# EAGLE design IM920sL_module (EAGLE 9.6.2)
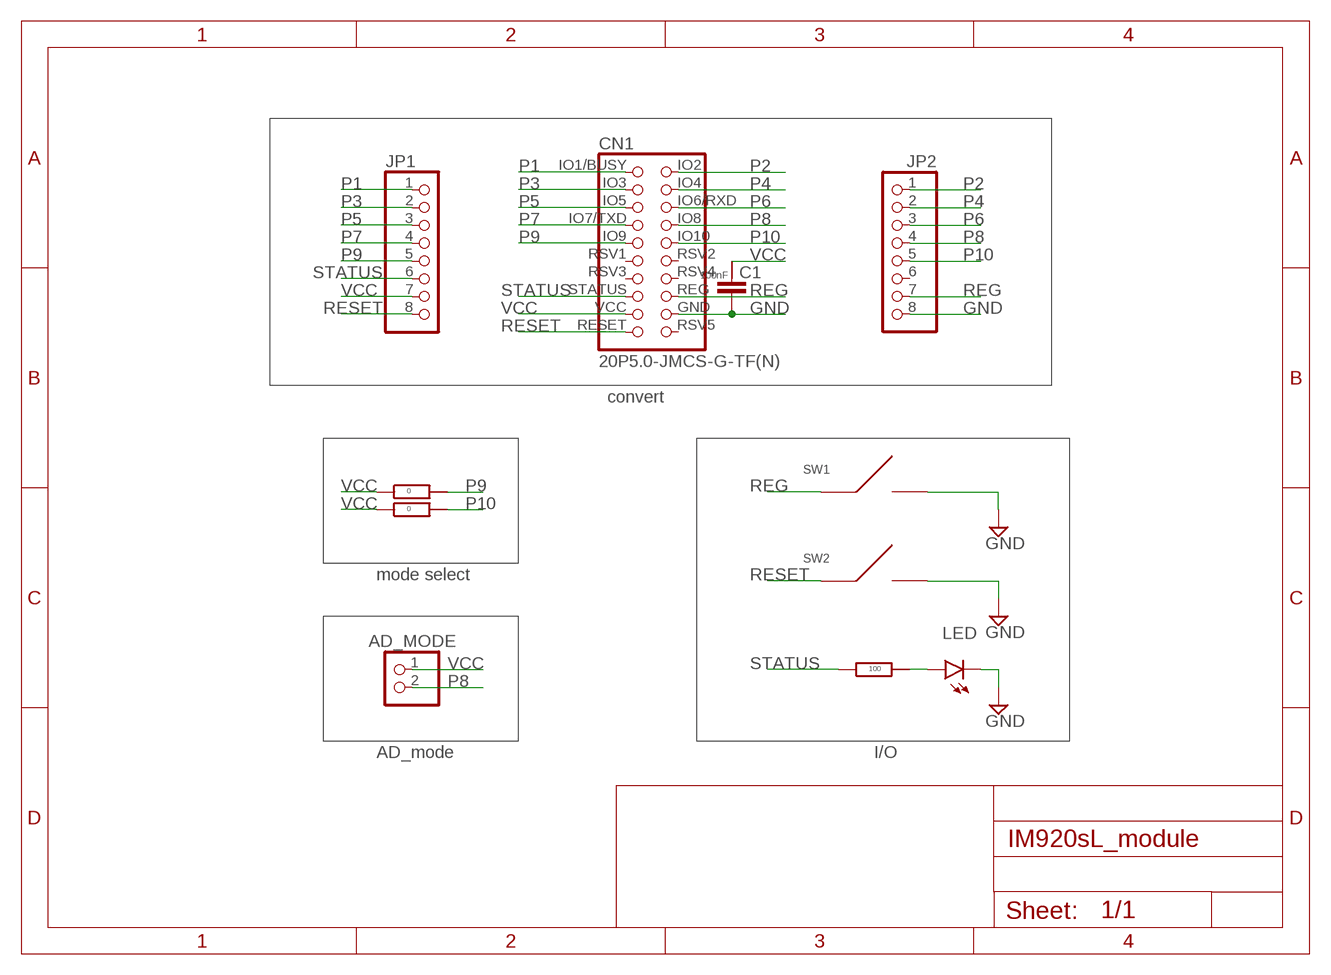
[diagram p0: schematic, sheet 1]

## Parts
AD_MODE  PINHD-1X2  [1X02]
C1  GCM188L81H104KA57  [GCM188L81H104KA57]
CN1  20P5.0-JMCS-G-TF(N)  [20P5.0-JMCS-G-TF(N)]
JP1  PINHD-1X8  [1X08]
JP2  PINHD-1X8  [1X08]
LED  SML-E12V8WT86  [SML-E12V8WT86]
R1  RG2012N-101-B-T5  [RG2012]
R2  RG2012-0Ω  [RG2012]
R3  RG2012-0Ω  [RG2012]
SW1  一般的なタクトスイッチ  [一般的なタクトスイッチ]
SW2  一般的なタクトスイッチ  [一般的なタクトスイッチ]

## Nets
GND: C1.P$2 CN1.GND JP2.8 LED.K(C) SW1.T2 SW2.T2
N$1: LED.A R1.LEFT
P1: CN1.IO1/BUSY JP1.1
P2: CN1.IO2 JP2.1
P3: CN1.IO3 JP1.2
P4: CN1.IO4 JP2.2
P5: CN1.IO5 JP1.3
P6: CN1.IO6/RXD JP2.3
P7: CN1.IO7/TXD JP1.4
P8: AD_MODE.2 CN1.IO8 JP2.4
P9: CN1.IO9 JP1.5 R2.LEFT
P10: CN1.IO10 JP2.5 R3.LEFT
REG: CN1.REG JP2.7 SW1.T4
RESET: CN1.RESET JP1.8 SW2.T4
STATUS: CN1.STATUS JP1.6 R1.RIGHT
VCC: AD_MODE.1 C1.P$1 CN1.VCC JP1.7 R2.RIGHT R3.RIGHT
Unconnected: CN1.RSV1 CN1.RSV2 CN1.RSV3 CN1.RSV4 CN1.RSV5 JP2.6

## Notes on the sheet
- convert
- mode select
- AD_mode | I/O

## Library data of the parts
AD_MODE = pinhead:PINHD-1X2: PIN HEADER
C1 = GCM188L81H104K57(0.1uF):GCM188L81H104KA57
CN1 = IM920SL:20P5.0-JMCS-G-TF(N)
JP1 JP2 = pinhead:PINHD-1X8: PIN HEADER
LED = SML-E12V8WT86:SML-E12V8WT86
R1 = RG2012N-101-B-T5:RG2012N-101-B-T5
R2 R3 = RG2012_0Ω:RG2012-0Ω
SW1 SW2 = 一般的なタクトスイッチ:一般的なタクトスイッチ

## Board
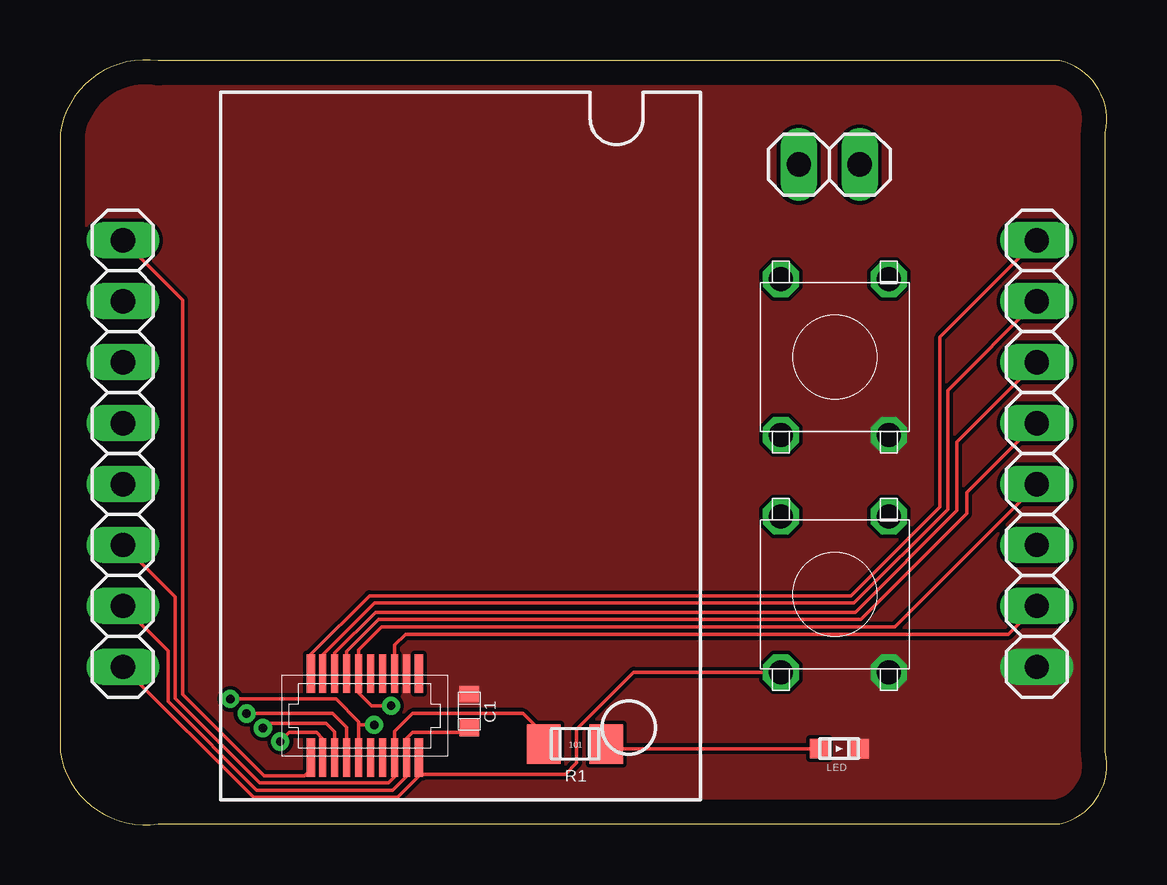
[diagram p1: board, top side]
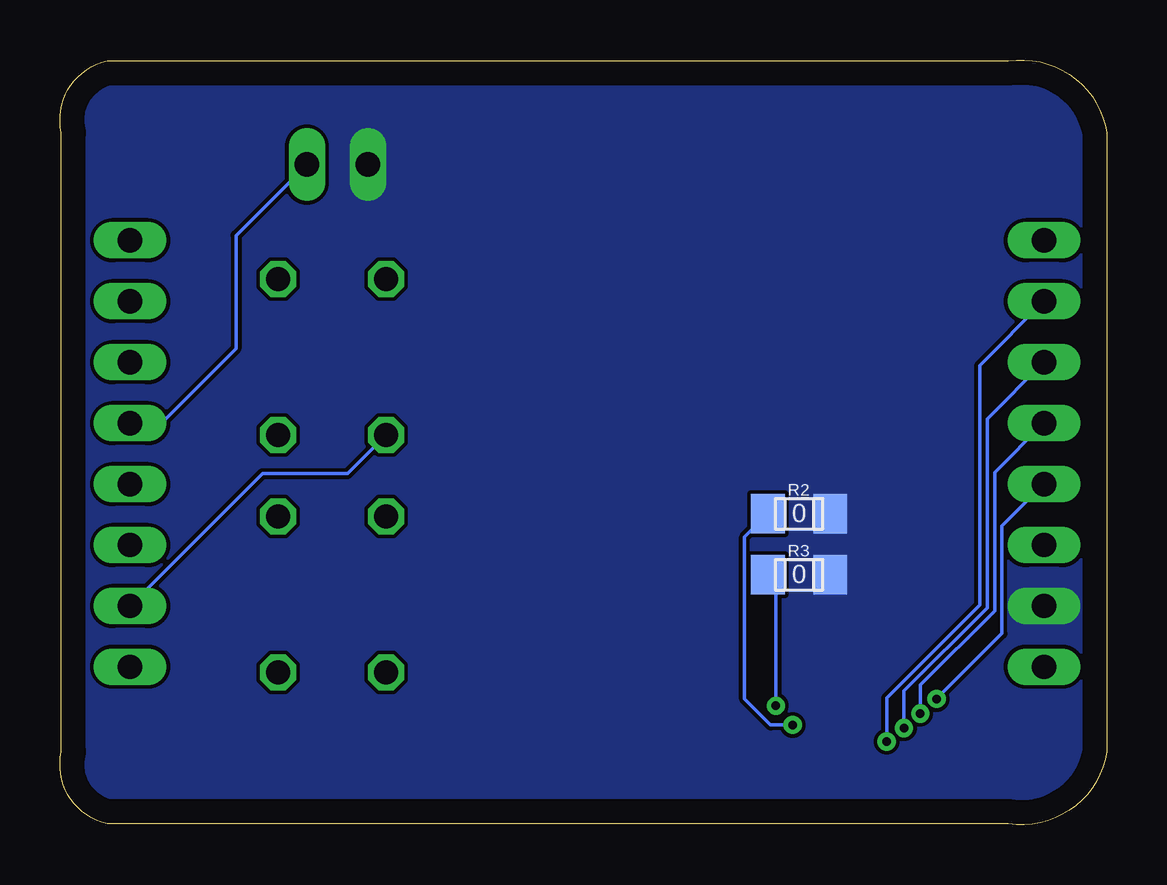
[diagram p2: board, bottom side, seen from below]

Size 43.64 x 31.88 mm. Coordinates in mm from the lower left corner, seen from the top.
Outline: 0,28.84 0,3.04 arc90 4.1,0.04 41.68,0.04 arc90 43.58,3.04 43.58,28.84 arc90 41.68,31.84 4.1,31.84 arc90 0,28.84
Copper layers (1*16): Top 0.035mm / dielectric 1.5mm / Bottom 0.035mm
Design rules "default": minimum track width 6mil, minimum drill 0.35mm, track to track 6mil, track to pad 6mil, pad to pad 6mil, via to via 6mil, smd to smd 6mil, copper to edge 40mil, drill to drill 6mil, minimum pad ring 10mil, minimum via ring 8mil, stop-mask expansion 4mil, vias tented up to drill 0mil, thermal gap 10mil

### Footprints (pad centres in the part's own frame; a part is rotated, then mirrored left to right if it is on the bottom)
1X02 = drill 1.016 long: 1 -1.27,0; 2 1.27,0
GCM188L81H104KA57 = smd 0.7 x 0.8: P$1 -0.7,0; P$2 0.7,0
20P5.0-JMCS-G-TF(N) = smd 0.3 x 1.6: GND 2,1.75; IO3 -1.5,-1.75; IO4 -1.5,1.75; IO5 -1,-1.75; IO6/RXD -1,1.75; IO7/TXD -0.5,-1.75; IO8 -0.5,1.75; IO9 0,-1.75; IO10 0,1.75; REG 1.5,1.75; RSV1 0.5,-1.75; RSV2 0.5,1.75; RSV3 1,-1.75; RSV4 1,1.75; STATUS 1.5,-1.75; VCC 2,-1.75 | smd 0.35 x 1.6: IO1/BUSY -2,-1.75; IO2 -2,1.75; RESET 2.5,-1.75; RSV5 2.5,1.75
1X08 = drill 1.016 long: 1 -8.89,0; 2 -6.35,0; 3 -3.81,0; 4 -1.27,0; 5 1.27,0; 6 3.81,0; 7 6.35,0; 8 8.89,0
SML-E12V8WT86 = smd 0.8 x 0.8: A 0,1.65; K 0,0
RG2012 = smd 1.4 x 1.65: LEFT 0,0; RIGHT 2.6,0
一般的なタクトスイッチ = drill 1 octagon: T1 -3.25,2.25; T2 3.25,2.25; T3 -3.25,-2.25; T4 3.25,-2.25

### Placement (x,y rotation side)
AD_MODE  32.07,27.52 0 top
C1  17.06,4.74 90 top
CN1  12.45,4.54 0 top
JP1  2.62,15.47 270 top
JP2  40.72,15.47 270 top
LED  33.31,3.17 90 top
R1  22.77,3.36 180 top
R2  14.13,12.96 0 bottom
R3  14.13,10.42 0 bottom
SW1  32.3,19.5 270 top
SW2  32.3,9.6 270 top

### Tracks (layer width: path | path; a pad name or v marks a point on that pad's centre or on a via)
GND
  pour Top (no thermals): -6.6,36.34 -6.6,-3.26 45.1,-3.26 45.1,35.24 44,36.34
N$1
  Top 0.152: R1.LEFT 22.97,3.16 LED.A
P1
  Top 0.152: CN1.IO1/BUSY 10.45,2.3 10.2,2.05 8.5,2.05 5.11,5.44 5.11,21.87 JP1.1
P2
  Top 0.152: CN1.IO2 10.45,7.09 12.9,9.55 32.97,9.55 36.68,13.26 36.68,20.32 JP2.1
P3  (via drill 0.35)
  Top 0.152: CN1.IO3 10.95,3.59 10.7,3.84 9.56,3.84 v9.18,3.46
  Bottom 0.152: v9.18,3.46 9.18,5.28 5.3,9.16 5.3,19.14 JP1.2
P4
  Top 0.152: CN1.IO4 10.97,6.31 10.97,7.11 13.11,9.24 33.1,9.24 37,13.14 37,18.1 JP2.2
P5  (via drill 0.35)
  Top 0.152: CN1.IO5 11.45,3.88 11.1,4.23 8.66,4.23 v8.46,4.03
  Bottom 0.152: v8.46,4.03 8.46,5.57 4.98,9.05 4.98,16.92 JP1.3
P6
  Top 0.152: CN1.IO6/RXD 11.45,7.15 13.15,8.85 33.15,8.85 37.4,13.1 37.4,15.96 JP2.3
P7  (via drill 0.35)
  Top 0.152: CN1.IO7/TXD 11.95,4.06 11.37,4.64 v7.78,4.64 v7.78,4.63
  Bottom 0.152: JP1.4 4.68,14.68 4.68,8.92 7.78,5.82 v7.78,4.63
P8
  Top 0.152: CN1.IO8 11.95,7.22 13.28,8.55 33.38,8.55 37.8,12.97 37.8,13.84 40.7,16.74 JP2.4
  Bottom 0.152: AD_MODE.2 36.3,24.56 36.3,19.84 39.4,16.74 JP2.4
P9  (via drill 0.35)
  Top 0.152: 12.4,2.84 CN1.IO9 12.45,4.14 | 12.45,4.14 12.45,4.29 11.5,5.24 v7.1,5.24 | v13.1,4.16 12.47,4.16 12.45,4.14
  Bottom 0.152: v7.1,5.24 4.37,7.97 4.37,12.45 JP1.5 | R2.LEFT 15.1,11.99 15.1,5.24 14.02,4.16 v13.1,4.16
P10  (via drill 0.35)
  Top 0.152: JP2.5 40.72,14.16 34.8,8.25 13.4,8.25 12.45,7.29 CN1.IO10 12.45,5.49 12.98,4.96 v13.8,4.96
  Bottom 0.152: R3.LEFT 13.8,10.09 v13.8,4.96
REG
  Top 0.152: CN1.REG 13.95,7.49 14.4,7.94 39.54,7.94 JP2.7
  Bottom 0.152: SW1.T4 31.66,14.64 35.2,14.64 JP2.7
RESET
  Top 0.152: JP1.8 8.07,1.13 14.06,1.13 14.95,2.02 | 14.95,2.02 15.04,2.1 21.06,2.1 21.54,2.58 21.54,3.98 23.91,6.35 SW2.T4 | 14.95,3.34 CN1.RESET 14.95,2.02
STATUS
  Top 0.152: JP1.6 2.64,11.66 4.8,9.5 4.8,5.26 8.33,1.74 13.7,1.74 13.95,1.99 CN1.STATUS 13.95,3.89 14.7,4.64 19.3,4.64 20.17,3.77 R1.RIGHT
VCC
  Top 0.152: JP1.7 4.5,7.24 4.5,5.14 8.2,1.44 13.87,1.44 14.43,2 14.43,2.77 CN1.VCC 14.45,3.59 14.7,3.84 16.86,3.84 C1.P$1
  pour Bottom (no thermals): -2.2,35.24 -2.2,-1.06 44,-1.06 44,34.14 42.9,35.24